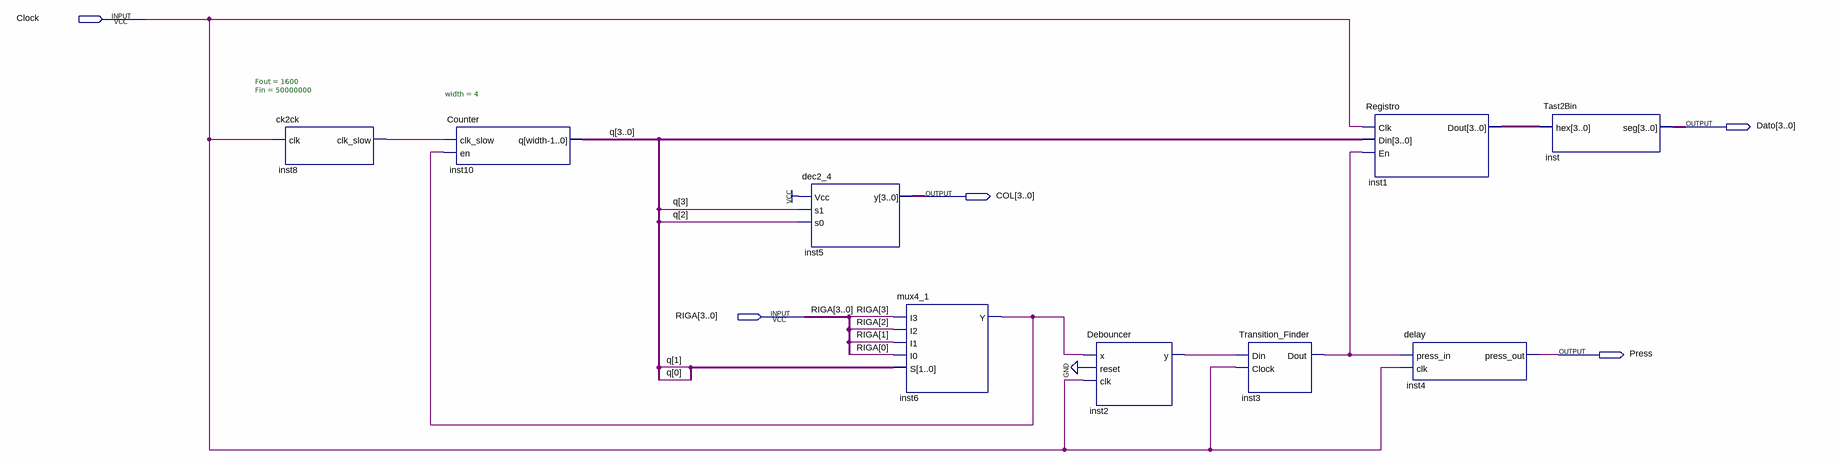
[diagram p0: schematic sheet]
// Quartus schematic Tastierino.bdf as structural Verilog: 9 symbols, 5 pins
module Tastierino (
  input  Clock,
  input  [3:0] RIGA,
  output [3:0] Dato,
  output [3:0] COL,
  output Press
);

  wire inst2_y, inst3_dout, inst6_y, inst8_clk_slow;
  wire [1:0] undriven;
  wire [3:0] inst1_dout, q;

  ck2ck #(.Fout(1600), .Fin(50000000)) inst8 (.clk(Clock), .clk_slow(inst8_clk_slow));
  Counter #(.width(4)) inst10 (.clk_slow(inst8_clk_slow), .en(inst6_y), .q(q));
  dec2_4 inst5 (.Vcc(1'b1), .s1(q[3]), .s0(q[2]), .y(COL));
  mux4_1 inst6 (.I3(RIGA[3]), .I2(RIGA[2]), .I1(RIGA[1]), .I0(RIGA[0]), .S(undriven), .Y(inst6_y));
  Debouncer inst2 (.x(inst6_y), .reset(1'b0), .clk(Clock), .y(inst2_y));
  Transition_Finder inst3 (.Din(inst2_y), .Clock(Clock), .Dout(inst3_dout));
  Registro inst1 (.Clk(Clock), .Din(q), .En(inst3_dout), .Dout(inst1_dout));
  delay inst4 (.press_in(inst3_dout), .clk(Clock), .press_out(Press));
  Tast2Bin inst (.hex(inst1_dout), .seg(Dato));
endmodule
